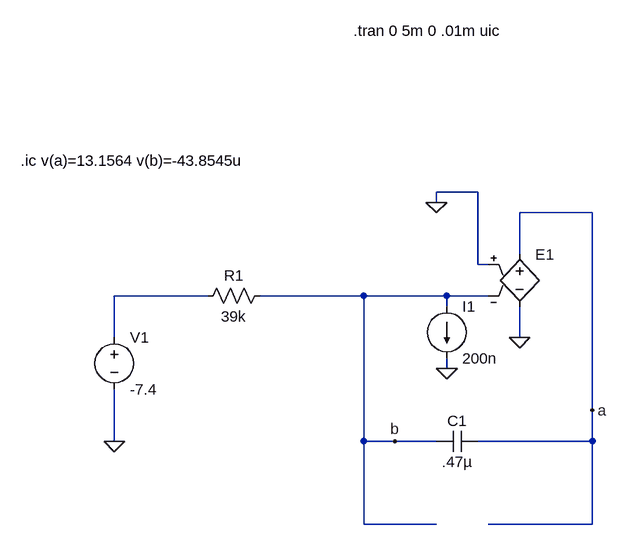
[diagram p0: schematic intideal1.asc]
intideal1.asc, the LTspice schematic file:
Version 4
SHEET 1 1748 680
WIRE 784 -16 720 -16
WIRE 720 0 720 -16
WIRE 960 16 848 16
WIRE 848 80 848 16
WIRE 784 96 784 -16
WIRE 800 96 784 96
WIRE 368 144 224 144
WIRE 608 144 448 144
WIRE 736 144 608 144
WIRE 800 144 736 144
WIRE 736 160 736 144
WIRE 224 208 224 144
WIRE 848 208 848 160
WIRE 736 256 736 240
WIRE 960 320 960 16
WIRE 224 368 224 288
WIRE 608 368 608 144
WIRE 656 368 608 368
WIRE 720 368 656 368
WIRE 960 368 960 320
WIRE 960 368 784 368
WIRE 608 496 608 368
WIRE 720 496 608 496
WIRE 960 496 960 368
WIRE 960 496 800 496
FLAG 848 208 0
FLAG 224 368 0
FLAG 720 0 0
FLAG 960 320 a
FLAG 736 256 0
FLAG 656 368 b
SYMBOL e 848 64 R0
WINDOW 3 24 96 Invisible 2
SYMATTR Value table=(-100,-15)(-50u,-15)(50u,15)(100,15)
SYMATTR InstName E1
SYMBOL cap 784 352 R90
WINDOW 0 0 32 VBottom 2
WINDOW 3 32 32 VTop 2
SYMATTR InstName C1
SYMATTR Value .47µ
SYMBOL res 464 128 R90
WINDOW 0 0 56 VBottom 2
WINDOW 3 32 56 VTop 2
SYMATTR InstName R1
SYMATTR Value 39k
SYMBOL current 736 160 R0
WINDOW 123 0 0 Left 2
WINDOW 39 0 0 Left 2
SYMATTR InstName I1
SYMATTR Value 200n
SYMBOL voltage 224 192 R0
WINDOW 123 0 0 Left 2
WINDOW 39 0 0 Left 2
SYMATTR InstName V1
SYMATTR Value -7.4
TEXT 592 -264 Left 2 !.tran 0 5m 0 .01m uic
TEXT 80 -64 Left 2 !.ic v(a)=13.1564 v(b)=-43.8545u

The netlist it stands for:
* intideal1.asc
E1 a 0 0 b table=(-100,-15)(-50u,-15)(50u,15)(100,15)
C1 a b .47µ
R1 b N001 39k
I1 b 0 200n
V1 N001 0 -7.4
.tran 0 5m 0 .01m uic
.ic v(a)=13.1564 v(b)=-43.8545u
.backanno
.end